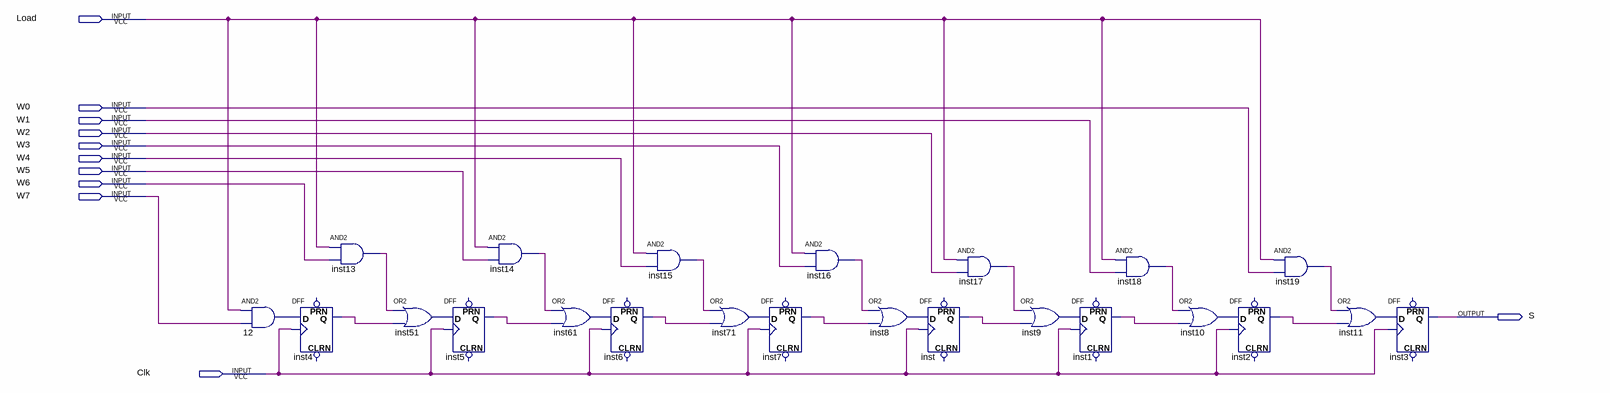
[diagram p0: schematic sheet]
// Quartus schematic 8-bit_p-in_s-out_r-s_regiser.bdf as structural Verilog: 23 symbols, 11 pins
module \8-bit_p-in_s-out_r-s_regiser  (
  input  Load,
  input  W0,
  input  W1,
  input  W2,
  input  W3,
  input  W4,
  input  W5,
  input  W6,
  input  W7,
  input  Clk,
  output S
);

  wire inst1_q, inst2_q, inst4_q, inst5_q, inst6_q, inst7_q, inst8_out, inst9_out, inst10_out, inst11_out,
       inst13_out, inst14_out, inst15_out, inst16_out, inst17_out, inst18_out, inst19_out, inst51_out,
       inst61_out, inst71_out, inst_q, n12_out;

  and u_12 (n12_out, Load, W7);
  DFF inst4 (.CLK(Clk), .D(n12_out), .Q(inst4_q));  // open: CLRN, PRN
  and inst13 (inst13_out, Load, W6);
  or inst51 (inst51_out, inst13_out, inst4_q);
  DFF inst5 (.CLK(Clk), .D(inst51_out), .Q(inst5_q));  // open: CLRN, PRN
  and inst14 (inst14_out, Load, W5);
  or inst61 (inst61_out, inst14_out, inst5_q);
  and inst15 (inst15_out, Load, W4);
  DFF inst6 (.CLK(Clk), .D(inst61_out), .Q(inst6_q));  // open: CLRN, PRN
  or inst71 (inst71_out, inst15_out, inst6_q);
  DFF inst7 (.CLK(Clk), .D(inst71_out), .Q(inst7_q));  // open: CLRN, PRN
  and inst16 (inst16_out, Load, W3);
  or inst8 (inst8_out, inst16_out, inst7_q);
  DFF inst (.CLK(Clk), .D(inst8_out), .Q(inst_q));  // open: CLRN, PRN
  and inst17 (inst17_out, Load, W2);
  or inst9 (inst9_out, inst17_out, inst_q);
  DFF inst1 (.CLK(Clk), .D(inst9_out), .Q(inst1_q));  // open: CLRN, PRN
  and inst18 (inst18_out, Load, W1);
  or inst10 (inst10_out, inst18_out, inst1_q);
  DFF inst2 (.CLK(Clk), .D(inst10_out), .Q(inst2_q));  // open: CLRN, PRN
  and inst19 (inst19_out, Load, W0);
  or inst11 (inst11_out, inst19_out, inst2_q);
  DFF inst3 (.CLK(Clk), .D(inst11_out), .Q(S));  // open: CLRN, PRN
endmodule
